# Altium schematic sheet Stepper-driver.SchDoc
size A4; SheetNumber: 2; SheetTotal: 3
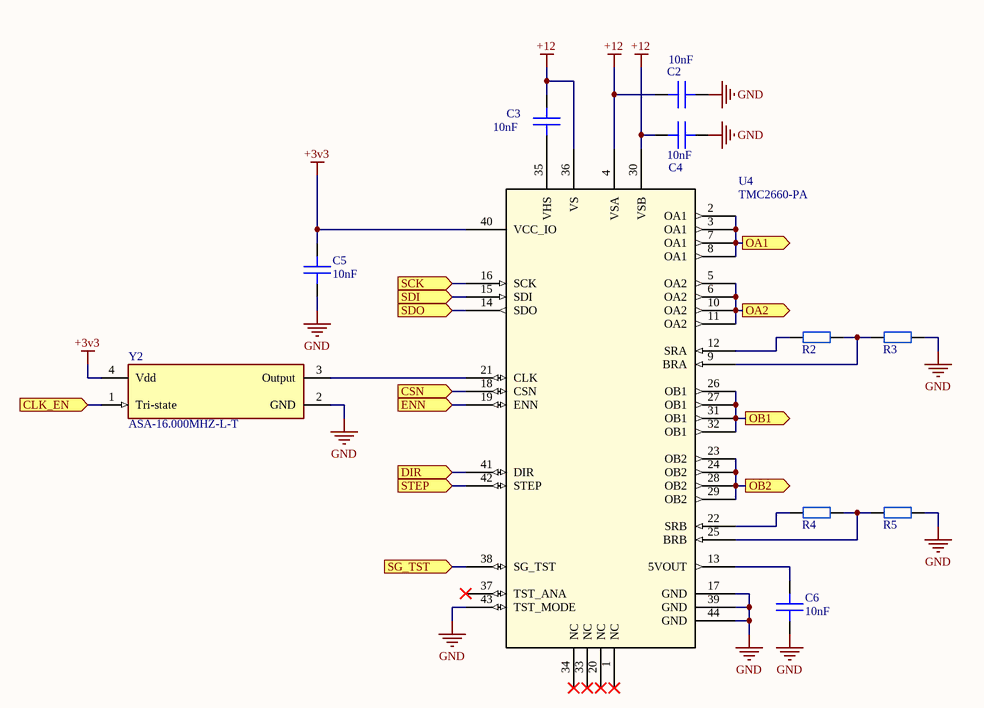
[diagram p0: Stepper-driver.SchDoc]

## Parts
C2  value 10nF  [C0603 (1608)]  (hidden comment: Cap SMD)
C3  value 10nF  [C0603 (1608)]  (hidden comment: Cap SMD)
C4  value 10nF  [C0603 (1608)]  (hidden comment: Cap SMD)
C5  value 10nF  [C0603 (1608)]  (hidden comment: Cap SMD)
C6  value 10nF  [C0603 (1608)]  (hidden comment: Cap SMD)
R2  Res  [R0603 (1608)]  (value not drawn)
R3  Res  [R0603 (1608)]  (value not drawn)
R4  Res  [R0603 (1608)]  (value not drawn)
R5  Res  [R0603 (1608)]  (value not drawn)
U4  TMC2660-PA  [LQFP44_12X12_TRI-M]
Y2  ASA-16.000MHZ-L-T  [FP-ASA-MFG]

## Ports
CLK_EN (in), CSN (in), DIR (in), ENN (in), OA1 (out), OA2 (out), OB1 (out), OB2 (out), SCK (in), SDI (in), SDO (in), SG_TST (in), STEP (in)

## Nets
+3v3: C5.2 U4.40(VCC_IO) Y2.4(Vdd)
+12: C2.2 C3.1 C4.2 U4.4(VSA) U4.30(VSB) U4.36(VS)
GND: C2.1 C4.1 C5.1 C6.1 R3.2 R5.2 U4.17(GND) U4.39(GND) U4.43(TST_MODE) U4.44(GND) Y2.2(GND)
CLK_EN: Y2.1(Tri-state) ; port CLK_EN
CSN: U4.18(CSN) ; port CSN
DIR: U4.41(DIR) ; port DIR
ENN: U4.19(ENN) ; port ENN
OA1: U4.2(OA1) U4.3(OA1) U4.7(OA1) U4.8(OA1) ; port OA1
OA2: U4.5(OA2) U4.6(OA2) U4.10(OA2) U4.11(OA2) ; port OA2
OB1: U4.26(OB1) U4.27(OB1) U4.31(OB1) U4.32(OB1) ; port OB1
OB2: U4.23(OB2) U4.24(OB2) U4.28(OB2) U4.29(OB2) ; port OB2
SCK: U4.16(SCK) ; port SCK
SDI: U4.15(SDI) ; port SDI
SDO: U4.14(SDO) ; port SDO
SG_TST: U4.38(SG_TST) ; port SG_TST
STEP: U4.42(STEP) ; port STEP
NetC3_2: C3.2 U4.35(VHS)
NetC6_2: C6.2 U4.13(5VOUT)
NetR2_1: R2.1 U4.12(SRA)
NetR2_2: R2.2 R3.1 U4.9(BRA)
NetR4_1: R4.1 U4.22(SRB)
NetR4_2: R4.2 R5.1 U4.25(BRB)
NetU4_21: U4.21(CLK) Y2.3(Output)

Not connected (* = marked no-connect by the designer): U4 1(NC)* 20(NC)* 33(NC)* 34(NC)* 37(TST_ANA)*

## Library data of the parts
R2-R5 = Resistor EU
U4 = TMC2660-PA: No Description Available; Built_By: EMA_Jessica; Vendor: TRINAMIC; SourceLibrary: Trinamic_2018-10-17; Copyright: Copyright (C) 2016 Accelerated Designs. All rights reserved; Manufacturer_Part_Number: TMC2660-PA; RefDes: RefDes; Type: DEV
Y2 = CMP-27762-000001-1: XTAL OSC XO 16.0000MHZ HCMOS SMD; Manufacturer: Abracon; Max Supply Current: 5mA; Max Supply Voltage: 3.66V; Load Capacitance: 15pF; Stability: 50ppm; Frequency: 16MHz; Min Supply Voltage: 2.97V; Category: Crys; Package: ASA; Temperature Range High: +85°C; Device Class L1: Passive Components; Octopart: https://octopart.com/asa-16.000mhz-l-t-abracon-21707822; Device Class L3: Oscillators; Temperature Range Low: -40°C; ComponentLink2Description: Datasheet; Mouser Description: Standard Clock Oscillators 16.000MHz 3.3V -40C +85C; Height: 0.8mm; Series: ASA; Automotive: No; Device Class L2: Crystals / Oscillators; Manufacturer Part Number: ASA-16.000MHZ-L-T; ComponentLink2URL: https://abracon.com/Oscillators/ASA.pdf; Digikey Description: XTAL OSC XO 16.0000MHZ HCMOS SMD; Footprint Url: https://abracon.com/Support/PackageDrawing/Oscillators/ASA.PDF; Temperature: -40°C to +85°C; RoHS: TRUE; Lead Free: Yes